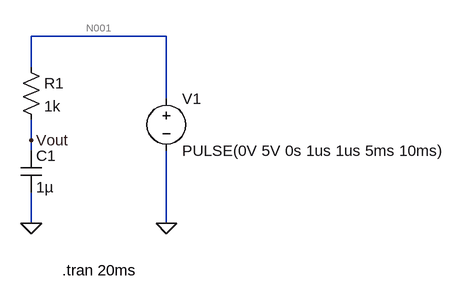
[diagram p0: schematic RC.asc]
RC.asc, the LTspice schematic file:
Version 4.1
SHEET 1 1980 680
WIRE 288 32 80 32
WIRE 80 80 80 32
WIRE 288 128 288 32
WIRE 80 192 80 160
WIRE 80 208 80 192
WIRE 80 320 80 272
WIRE 288 320 288 208
FLAG 80 320 0
FLAG 288 320 0
FLAG 80 192 Vout
SYMBOL voltage 288 112 R0
WINDOW 123 0 0 Left 0
WINDOW 39 0 0 Left 0
SYMATTR InstName V1
SYMATTR Value PULSE(0V 5V 0s 1us 1us 5ms 10ms)
SYMBOL res 64 64 R0
SYMATTR InstName R1
SYMATTR Value 1k
SYMBOL cap 64 208 R0
SYMATTR InstName C1
SYMATTR Value 1µ
TEXT 128 392 Left 2 !.tran 20ms

The netlist it stands for:
* RC.asc
V1 N001 0 PULSE(0V 5V 0s 1us 1us 5ms 10ms)
R1 N001 Vout 1k
C1 Vout 0 1µ
.tran 20ms
.backanno
.end

* Results of the author's LTspice run, read from the files saved beside the schematic
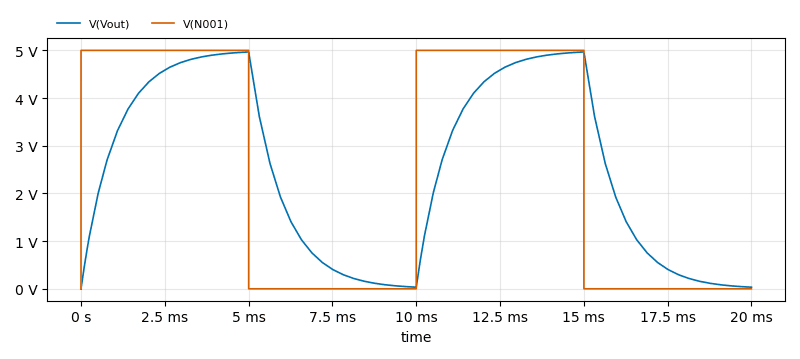
[diagram p1: Transient Analysis of RC.asc, plotted from the saved traces]
* Transient Analysis, 1 run:
*   V(Vout): min 0 V, max 4.967 V, average 2.5 V, rms 3.172 V, last 33.51 mV
*   V(N001): min 0 V, max 5 V, average 2.501 V, rms 3.536 V, last 0 V